# Altium schematic sheet SCH_arduino_uno_cong.SchDoc
size 420 x 297 mm; SheetNumber: 1; SheetTotal: 1
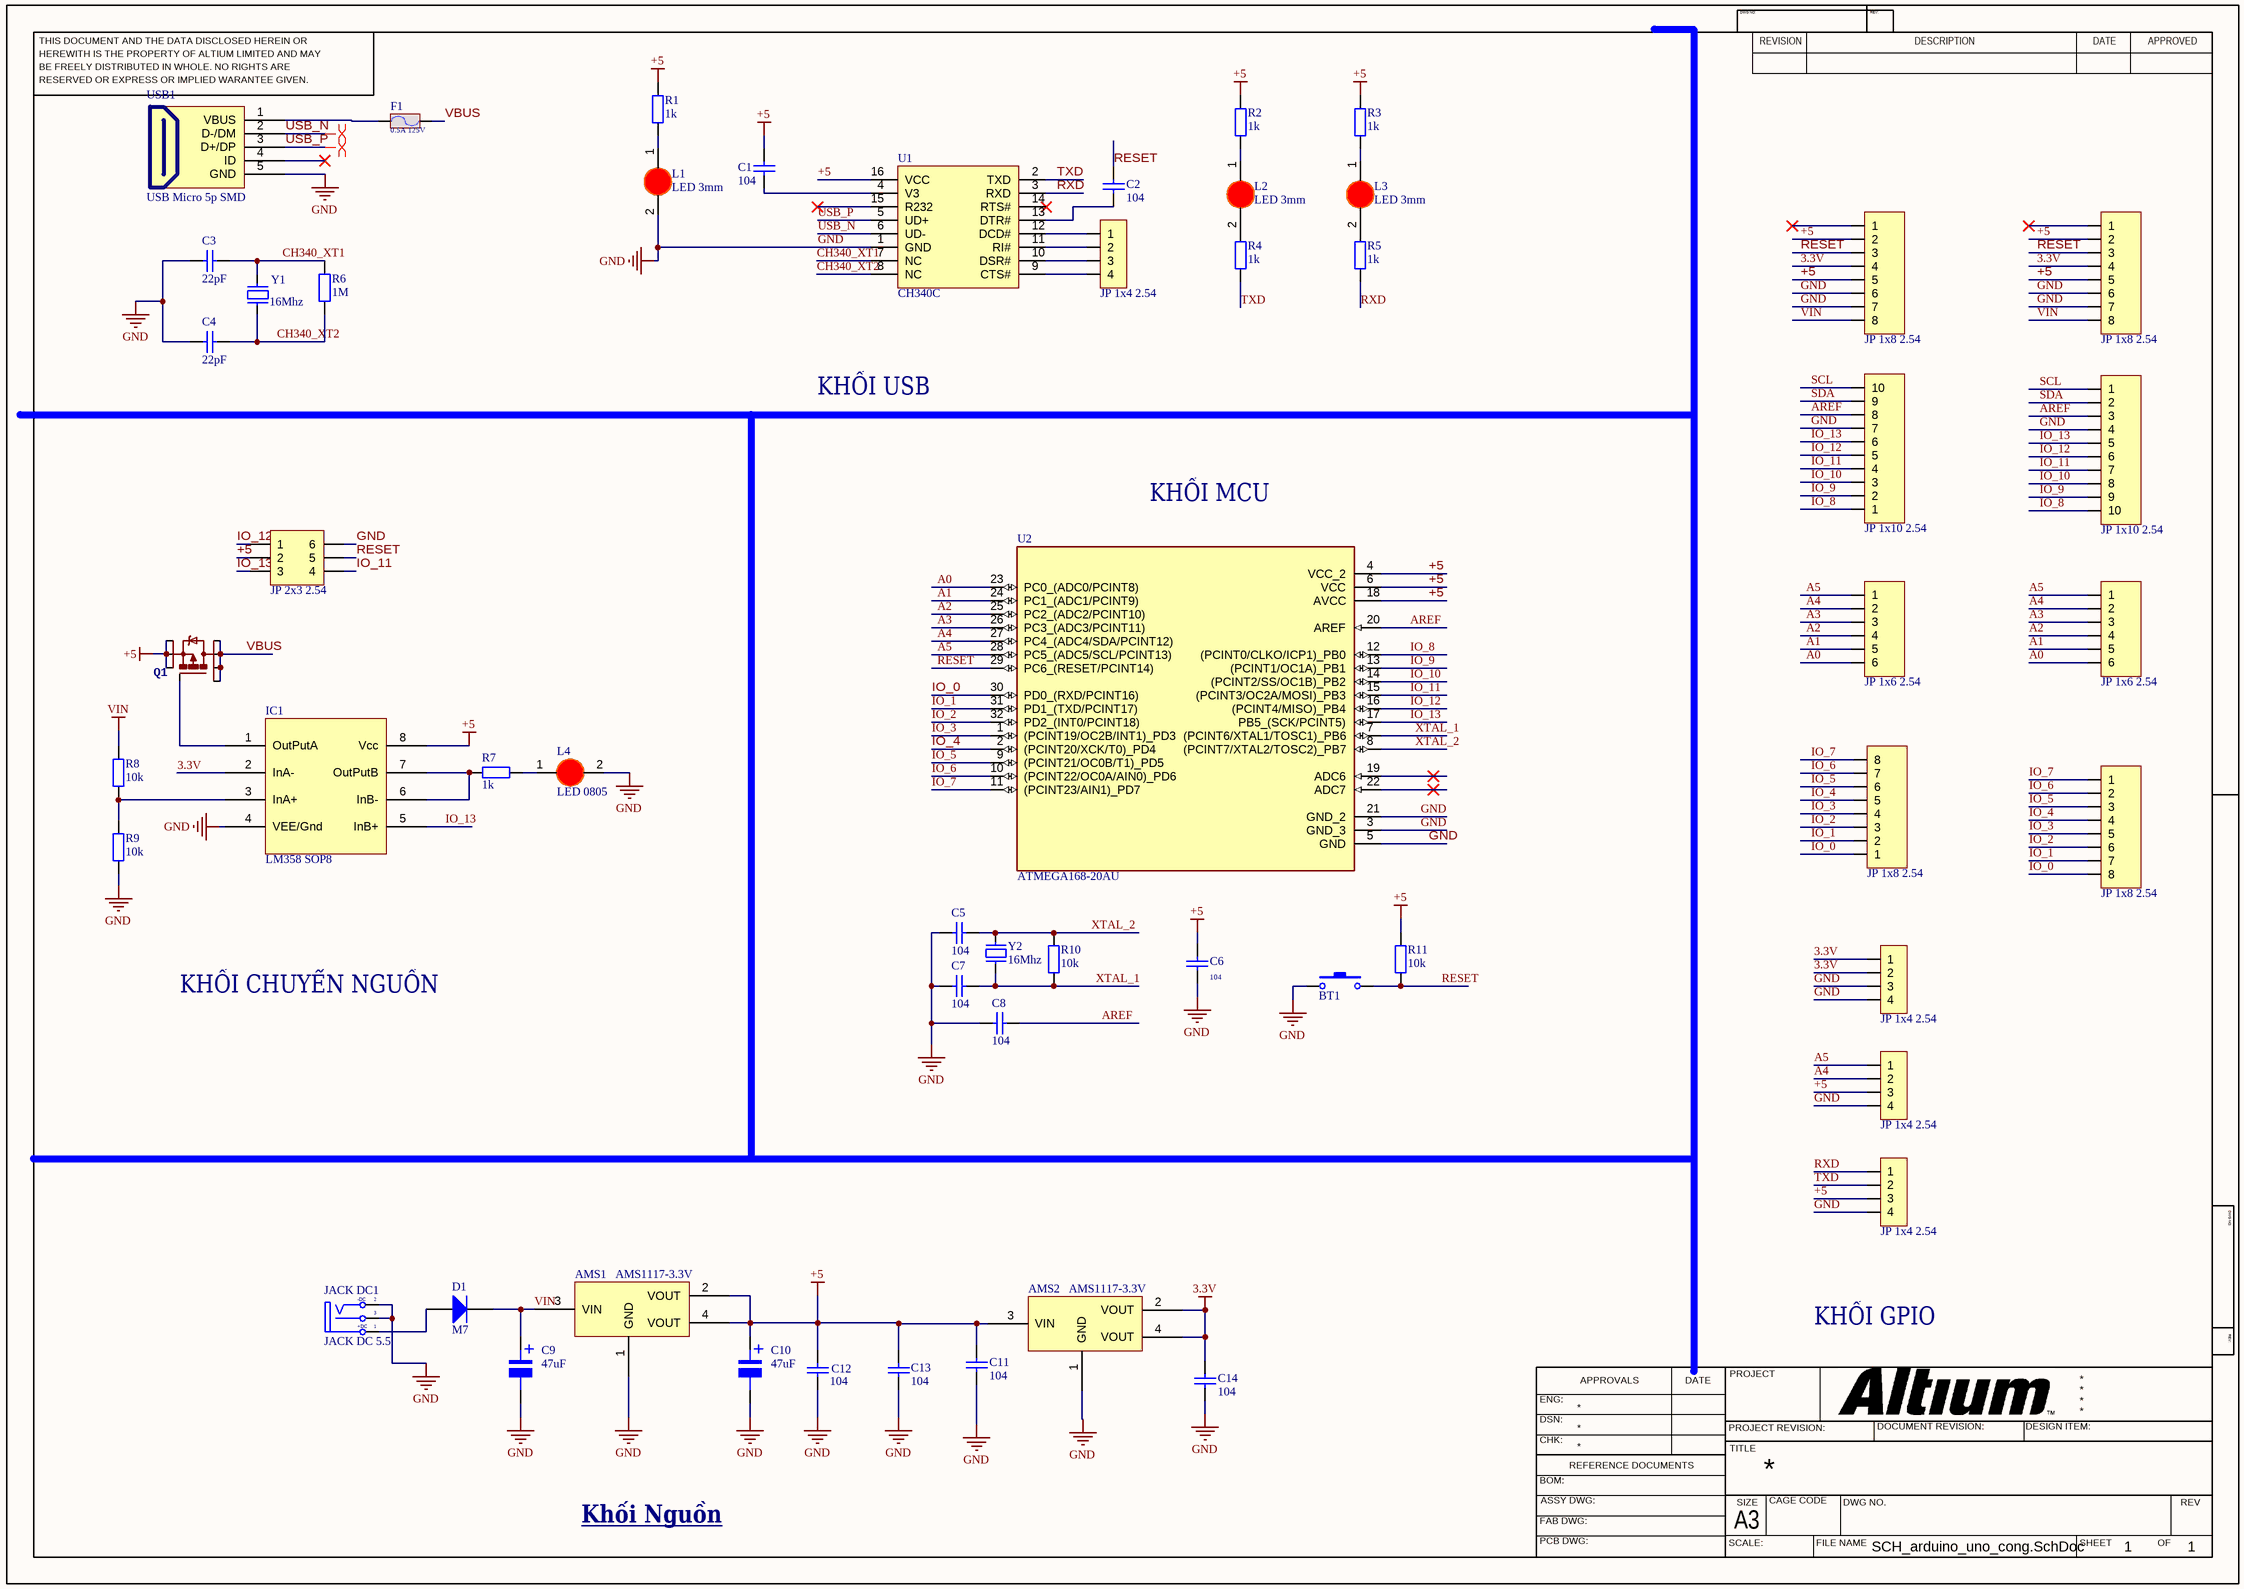
[diagram p0: SCH_arduino_uno_cong.SchDoc]

## Parts
AMS1  AMS1117-3.3V  [SOT223]
AMS2  AMS1117-3.3V  [SOT223]
BT1  Nut Nhan 2 Chan SMD 3x6x2.5  [Nut Nhan 2 Chan SMD 3x6x2.5]  (value not drawn)
C1  104  [tu 0805]
C2  104  [tu 0805]
C3  22pF  [tu 0805]
C4  22pF  [tu 0805]
C5  104  [tu 0805]
C6  104  [tu 0805]
C7  104  [tu 0805]
C8  104  [tu 0805]
C9  47uF  [tu nhom 6.3 (d)]
C10  47uF  [tu nhom 6.3 (d)]
C11  104  [tu 0805]
C12  104  [tu 0805]
C13  104  [tu 0805]
C14  104  [tu 0805]
D1  M7  [DIODE SMA]
F1  0.5A 125V  [Cau Chi SMD1808]
IC1  LM358 SOP8  [SOP 8]
JACK_DC1  JACK DC 5.5  [JACK DC 5.5]
JP1  JP 1x8 2.54  [JP 1x8 CT]
JP2  JP 1x8 2.54  [JP 1x8 DT]
JP3  JP 1x4 2.54  [JP 1x4 CT]
JP4  JP 1x10 2.54  [JP 1x10 CT]
JP5  JP 1x10 2.54  [JP 1x10 DT]
JP6  JP 2x3 2.54  [JP 2x3 DT]
JP7  JP 1x6 2.54  [JP 1x6 CT]
JP8  JP 1x6 2.54  [JP 1x6 DT]
JP9  JP 1x8 2.54  [JP 1x8 CT]
JP10  JP 1x8 2.54  [JP 1x8 DT]
JP11  JP 1x4 2.54  [JP 1x4 CT]
JP12  JP 1x4 2.54  [JP 1x4 CT]
JP13  JP 1x4 2.54  [JP 1x4 CT]
L1  LED 3mm  [LED-3MM-RED]
L2  LED 3mm  [LED-3MM-RED]
L3  LED 3mm  [LED-3MM-RED]
L4  LED 0805  [LED-0805-Red]
Q1  MOSFET_P  [SO-8]  (value not drawn)
R1  1k  [tro smd 0805]
R2  1k  [tro smd 0805]
R3  1k  [tro smd 0805]
R4  1k  [tro smd 0805]
R5  1k  [tro smd 0805]
R6  1M  [tro smd 0805]
R7  1k  [tro smd 0805]
R8  10k  [tro smd 0805]
R9  10k  [tro smd 0805]
R10  10k  [tro smd 0805]
R11  10k  [tro smd 0805]
U1  CH340C  [SOIC16_50_284_25X90_SMT]
U2  ATMEGA168-20AU  [ATMEGA168]
USB1  USB Micro 5p SMD  [USB Micro 5p SMD]
Y1  16Mhz  [Thach Anh 2 chan SMD]
Y2  16Mhz  [Thach Anh 2 chan SMD]

## Nets
3.3V: AMS2.2(VOUT) AMS2.4(VOUT) C14.2 IC1.2(InA-) JP1.4 JP2.4 JP11.1 JP11.2
+5: AMS1.2(VOUT) AMS1.4(VOUT) AMS2.3(VIN) C1.1 C6.1 C10.1 C11.2 C12.2 C13.2 IC1.8(Vcc) JP1.2 JP1.5 JP2.2 JP2.5 JP6.2 JP12.3 JP13.3 Q1.1(S) Q1.2(S) Q1.3(S) R1.2 R2.2 R3.2 R11.2 U1.16(VCC) U2.4(VCC_2) U2.6(VCC) U2.18(AVCC)
GND: AMS1.1(GND) AMS2.1(GND) BT1.1 C3.2 C4.2 C5.2 C6.2 C7.2 C8.2 C9.2 C10.2 C11.1 C12.1 C13.1 C14.1 IC1.4(VEE/Gnd) JACK_DC1.2(TN) JACK_DC1.3(S) JP1.6 JP1.7 JP2.6 JP2.7 JP4.7 JP5.4 JP6.6 JP11.3 JP11.4 JP12.4 JP13.4 L1.2(K) L4.2(K) R9.1 U1.1(GND) U2.3(GND_3) U2.5(GND) U2.21(GND_2) USB1.5(GND)
VIN: AMS1.3(VIN) C9.1 D1.2(K) JP1.8 JP2.8 R8.2
A0: JP7.6 JP8.6 U2.23(PC0_(ADC0/PCINT8))
A1: JP7.5 JP8.5 U2.24(PC1_(ADC1/PCINT9))
A2: JP7.4 JP8.4 U2.25(PC2_(ADC2/PCINT10))
A3: JP7.3 JP8.3 U2.26(PC3_(ADC3/PCINT11))
A4: JP7.2 JP8.2 JP12.2 U2.27(PC4_(ADC4/SDA/PCINT12))
A5: JP7.1 JP8.1 JP12.1 U2.28(PC5_(ADC5/SCL/PCINT13))
AREF: C8.1 JP4.8 JP5.3 U2.20(AREF)
CH340_XT1: C3.1 R6.2 U1.7(NC) Y1.2
CH340_XT2: C4.1 R6.1 U1.8(NC) Y1.1
IO_0: JP9.1 JP10.8 U2.30(PD0_(RXD/PCINT16))
IO_1: JP9.2 JP10.7 U2.31(PD1_(TXD/PCINT17))
IO_2: JP9.3 JP10.6 U2.32(PD2_(INT0/PCINT18))
IO_3: JP9.4 JP10.5 U2.1((PCINT19/OC2B/INT1)_PD3)
IO_4: JP9.5 JP10.4 U2.2((PCINT20/XCK/T0)_PD4)
IO_5: JP9.6 JP10.3 U2.9((PCINT21/OC0B/T1)_PD5)
IO_6: JP9.7 JP10.2 U2.10((PCINT22/OC0A/AIN0)_PD6)
IO_7: JP9.8 JP10.1 U2.11((PCINT23/AIN1)_PD7)
IO_8: JP4.1 JP5.10 U2.12((PCINT0/CLKO/ICP1)_PB0)
IO_9: JP4.2 JP5.9 U2.13((PCINT1/OC1A)_PB1)
IO_10: JP4.3 JP5.8 U2.14((PCINT2/SS/OC1B)_PB2)
IO_11: JP4.4 JP5.7 JP6.4 U2.15((PCINT3/OC2A/MOSI)_PB3)
IO_12: JP4.5 JP5.6 JP6.1 U2.16((PCINT4/MISO)_PB4)
IO_13: IC1.5(InB+) JP4.6 JP5.5 JP6.3 U2.17(PB5_(SCK/PCINT5))
RESET: BT1.2 C2.1 JP1.3 JP2.3 JP6.5 R11.1 U2.29(PC6_(RESET/PCINT14))
RXD: JP13.1 R5.1 U1.3(RXD)
SCL: JP4.10 JP5.1
SDA: JP4.9 JP5.2
TXD: JP13.2 R4.1 U1.2(TXD)
USB_N: U1.6(UD-) USB1.2(D-/DM)
USB_P: U1.5(UD+) USB1.3(D+/DP)
VBUS: F1.2 Q1.5(D) Q1.6(D) Q1.7(D) Q1.8(D)
XTAL_1: C7.1 R10.1 U2.7((PCINT6/XTAL1/TOSC1)_PB6) Y2.1
XTAL_2: C5.1 R10.2 U2.8((PCINT7/XTAL2/TOSC2)_PB7) Y2.2
NetC1_2: C1.2 U1.4(V3)
NetC2_2: C2.2 U1.13(DTR#)
NetD1_1: D1.1(A) JACK_DC1.1(T)
NetF1_1: F1.1 USB1.1(VBUS)
NetIC1_1: IC1.1(OutPutA) Q1.4(G)
NetIC1_3: IC1.3(InA+) R8.1 R9.2
NetIC1_6: IC1.6(InB-) IC1.7(OutPutB) R7.1
NetJP3_1: JP3.1 U1.12(DCD#)
NetJP3_2: JP3.2 U1.11(RI#)
NetJP3_3: JP3.3 U1.10(DSR#)
NetJP3_4: JP3.4 U1.9(CTS#)
NetL1_1: L1.1(A) R1.1
NetL2_1: L2.1(A) R2.1
NetL2_2: L2.2(K) R4.2
NetL3_1: L3.1(A) R3.1
NetL3_2: L3.2(K) R5.2
NetL4_1: L4.1(A) R7.2

Not connected (* = marked no-connect by the designer): JP1 1*; JP2 1*; U1 14(RTS#)* 15(R232)*; U2 19(ADC6)* 22(ADC7)*; USB1 4(ID)*

## Layout directives
differential pair: USB_N, USB_P

## Notes on the sheet
- KHỐI USB
- KHỐI MCU
- KHỐI CHUYỂN NGUỒN
- KHỐI GPIO
- Khối Nguồn
- THIS DOCUMENT AND THE DATA DISCLOSED HEREIN OR
- HEREWITH IS THE PROPERTY OF ALTIUM LIMITED AND MAY
- DWG NO:
- REVISION
- REV:
- DESCRIPTION
- DATE
- APPROVED
- BE FREELY DISTRIBUTED IN WHOLE. NO RIGHTS ARE
- RESERVED OR EXPRESS OR IMPLIED WARANTEE GIVEN.
- ENG:
- APPROVALS
- PROJECT
- DSN:
- CHK:
- REFERENCE DOCUMENTS
- PROJECT REVISION:
- TITLE
- DOCUMENT REVISION:
- DESIGN ITEM:
- BOM:
- FAB DWG:
- PCB DWG:
- ASSY DWG:
- SCALE:
- A3
- SIZE
- CAGE CODE
- FILE NAME
- DWG NO.
- SHEET
- OF
- REV
- (in symbol JACK DC 5.5) -DC; +DC
- (in symbol Tu Nhom 47uF 25V) +

## Library data of the parts
AMS1 AMS2 = AMS1117 SMD: Dán; Value: AMS1117-3.3V SOT223; Don_Vi: Con; Ma_Hang: MH000596; Ghi_Chu: *; Kieu_Chan: *; Chung_Loai: Dán
BT1 = Nut Nhan 2 Chan SMD 3x6x2.5: Ma_Hang: MH001036; Ten: Nút Nhấn 2 Chân 3x6x2.5MM SMD
C1 C2 C5-C8 C11-C14 = Tu 0805 104 50V 10%: Dán; Don_Vi: Con; So_Chan: 2; Ten_Linh_Kien: Tụ 0805 104-100nF 10% 50V; Ma_Hang: MH004551; Chung_Loai: Dán; Kieu_Chan: *
C3 C4 = Tu 0805 22pF 50V 10%: Dán; Don_Vi: Con; So_Chan: 2; Ten_Linh_Kien: Tụ 0805 22P 10% 50V; Ma_Hang: MH004560; Chung_Loai: Dán; Kieu_Chan: *
C9 C10 = Tu Nhom 47uF 25V: Dán; Don_Vi: Con; So_Chan: 2; Ten_Linh_Kien: Tụ Nhôm 47uF 25V 6.3x5.5MM; Ma_Hang: MH002216; Chung_Loai: Dán; Kieu_Chan: *
D1 = Diode M7 ( 4007 ): Dán; Don_Vi: Con; Ten_Linh_Kien: Diode M7 1N4007 SMD 1A 1000V; Ma_Hang: MH000944; Chung_Loai: Dán; Ghi_Chu: *
F1 = Cau chi 0.5A 125V SMD1808: Ma_Hang: MH009241; Ten: Cầu Chì 0.5A 125V SMD1808 0451.500MRL
IC1 = LM358 SOP8: Dán; Ma_Hang: MH000609; Don_Vi: Con; Ten_Linh_Kien: LM358 SOP8; Kieu_Chan: *; Ghi_Chu: *; Chung_Loai: Dán
JACK_DC1 = JACK DC 5.5: Value: Jac DC
JP1 JP9 = JP 1x8 2.54 Cai Thang: Cắm; Ten_Linh_Kien: Jump Đơn Cái 2.54MM 1x20P Thẳng; Don_Vi: Con; Ma_Hang: MH004006; Ghi_Chu: *; Kieu_Chan: *; Chung_Loai: Cắm
JP2 JP10 = JP 1x8 2.54 Duc Thang: Cắm; Ten_Linh_Kien: Jump Đơn Đực 2.54MM 1x40P Thẳng 11MM; Don_Vi: Con; Ma_Hang: MH000903; Ghi_Chu: *; Kieu_Chan: *; Chung_Loai: Cắm
JP3 JP11-JP13 = JP 1x4 2.54 Cai Thang: Cắm; Ten_Linh_Kien: Jump Đơn Cái 2.54MM 1x20P Thẳng; Don_Vi: Con; Ma_Hang: MH004006; Ghi_Chu: *; Kieu_Chan: *; Chung_Loai: Cắm
JP4 = JP 1x10 2.54 Cai Thang: Cắm; Ten_Linh_Kien: Jump Đơn Cái 2.54MM 1x20P Thẳng; Don_Vi: Con; Ma_Hang: MH004006; Ghi_Chu: *; Kieu_Chan: *; Chung_Loai: Cắm
JP5 = JP 1x10 2.54 Duc Thang: Cắm; Ten_Linh_Kien: Jump Đơn Đực 2.54MM 1x40P Thẳng 11MM; Don_Vi: Con; Ma_Hang: MH000903; Ghi_Chu: *; Kieu_Chan: *; Chung_Loai: Cắm
JP6 = JP 2x3 2.54 Duc Thang: Cắm; Ten_Linh_Kien: Jump Đôi Đực 2.54MM 2x40P Thẳng 11MM; Don_Vi: Con; Ma_Hang: MH002686; Ghi_Chu: *; Kieu_Chan: *; Chung_Loai: Cắm
JP7 = JP 1x6 2.54 Cai Thang: Cắm; Ten_Linh_Kien: Jump Đơn Cái 2.54MM 1x20P Thẳng; Don_Vi: Con; Ma_Hang: MH004006; Ghi_Chu: *; Kieu_Chan: *; Chung_Loai: Cắm
JP8 = JP 1x6 2.54 Duc Thang: Cắm; Ten_Linh_Kien: Jump Đơn Đực 2.54MM 1x40P Thẳng 11MM; Don_Vi: Con; Ma_Hang: MH000903; Ghi_Chu: *; Kieu_Chan: *; Chung_Loai: Cắm
L1-L3 = LED 3mm Do: Cắm; Don_Vi: Con; Ma_Hang: MH003892; Ten_Linh_Kien: Led 3MM Phủ Đỏ (10c); Ghi_Chu: *; Kieu_Chan: *; Chung_Loai: Cắm
L4 = LED 0805 Do: Dán; Don_Vi: Con; Ma_Hang: MH000897; Ten_Linh_Kien: LED 0805 Màu Đỏ (Red); Ghi_Chu: *; Kieu_Chan: *; Chung_Loai: Dán
Q1 = Q000008: MOSFET P-CH 30V 5.8A 8-SOIC; Manufacturer Part Number: IRF7406TRPBF; Manufacturer: Infineon Technologies Americas Corp.; FET Type: MOSFET P-Channel, Metal Oxide; FET Feature: Standard; Current - Continuous Drain (Id) @ 25°C: 5.8A (Ta); Rds On (Max) @ Id, Vgs: 45 mOhm @ 2.8A, 10V; Vgs(th) (Max) @ Id: 1V @ 250µA; Gate Charge (Qg) @ Vgs: 59nC @ 10V; Input Capacitance (Ciss) @ Vds: 1100pF @ 25V; Power - Max: 2.5W; Part Number: Q000008; HelpURL: http://www.irf.com/product-info/datasheets/data/irf7406pbf.pdf; Supplier 1: Digi-Key; Supplier Part Number 1: IRF7406PBFCT-ND; Drain to Source Voltage (Vdss): 30V; Operating Temperature: -55°C ~ 150°C (TJ)
R1-R5 = Tro 0805 1% 1k: Dán; Don_Vi: Con; So_Chan: 2; Ten_Linh_Kien: Trở 0805 1% 1k; Ma_Hang: MH005468; Chung_Loai: Dán; Kieu_Chan: *
R6 = Tro 0805 5% 1M: Dán; Don_Vi: Con; So_Chan: 2; Ten_Linh_Kien: Trở 0805 5% 1M; Ma_Hang: MH005235; Chung_Loai: Dán; Kieu_Chan: *
R7 = Tro 0805 5% 1k: Dán; Don_Vi: Con; So_Chan: 2; Ten_Linh_Kien: Trở 0805 5% 1k; Ma_Hang: MH005234; Chung_Loai: Dán; Kieu_Chan: *
R8-R10 = Tro 0805 1% 10k: Dán; Don_Vi: Con; So_Chan: 2; Ten_Linh_Kien: Trở 0805 1% 10k; Ma_Hang: MH005473; Chung_Loai: Dán; Kieu_Chan: *
R11 = Tro 0805 5% 10k: Dán; Don_Vi: Con; So_Chan: 2; Ten_Linh_Kien: Trở 0805 5% 10k; Ma_Hang: MH005239; Chung_Loai: Dán; Kieu_Chan: *
U1 = CH340C: USB Bridge, USB to UART USB 2.0 UART Interface; Manufacturer: Olimex; Alternate Part Number-1: NA; Manufacturer Part Number: CH340C; Case/Package: SOIC16; Supplier-1: LCSC; Supplier Part Number-1: C84681
U2 = ATMEGA168-20AU: AVR AVRÂ® ATmega Microcontroller IC 8-Bit 20MHz 16KB _8K x 16_ FLASH 32-TQFP _7x7_; MF: Microchip; MP: ATMEGA168-20AU; Availability: Unavailable; Package: TQFP-32 Microchip; Price: None; SnapEDA_Link: https://www.snapeda.com/parts/ATMEGA168-20AU/Microchip/view-part/776709/?ref=snap; Value: *
USB1 = USB Micro 5p SMD: USB Type B; Ten: MicroUSB MK5P SMD; Ma_Hang: MH001020
Y1 Y2 = Thach Anh 2 chan SMD: Crystal For all Crystal 2pin.; Value: 4Mhz